# Altium schematic sheet LPCB234 - PI.SchDoc
size A3; Address1: Factory 10; Address2: 9-13 Dingley Avenue, Dandeong, VICTORIA 3175, AUSTRALIA; DocumentNumber: 8; Revision: 1; SheetNumber: 8; SheetTotal: 10; Lockie__PCB_SUB_ASSEMBLY: PI Interface; Lockie__PCB_ASSEMBLY: Main; Lockie__LDL: LPCB234; Lockie__PCB_DESCRIPTION: RM4 Power Node
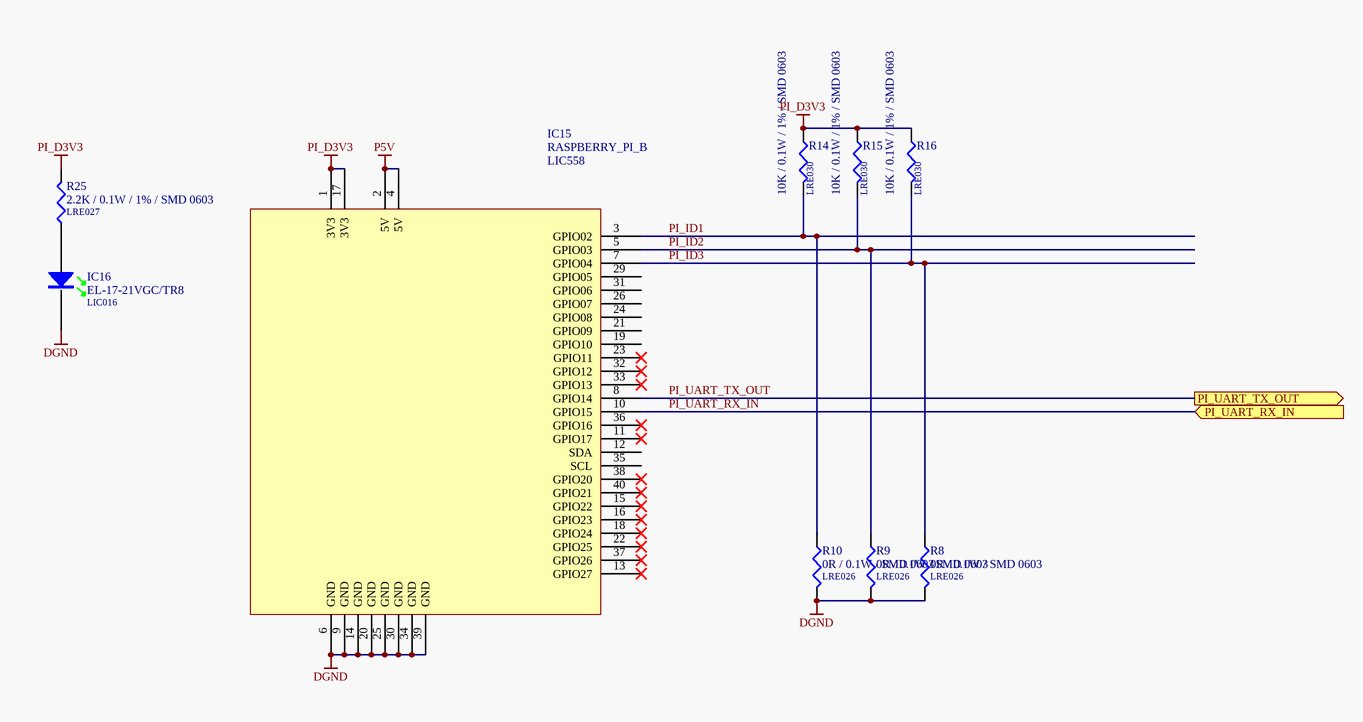
[diagram p0: LPCB234 - PI.SchDoc]

## Parts
IC15  RASPBERRY_PI_B  LDL_NUMBER: LIC558  [RASPBERRY_PI_B_VERT]
IC16  EL-17-21VGC/TR8  LDL_NUMBER: LIC016  [CR2012-0805-LED]
R8  0R / 0.1W / SMD 0603  LDL_NUMBER: LRE026  [LFP020__CR1608-0603-IPC7351_B]
R9  0R / 0.1W / SMD 0603  LDL_NUMBER: LRE026  [LFP020__CR1608-0603-IPC7351_B]
R10  0R / 0.1W / SMD 0603  LDL_NUMBER: LRE026  [LFP020__CR1608-0603-IPC7351_B]
R14  10K / 0.1W / 1% / SMD 0603  LDL_NUMBER: LRE030  [LFP020__CR1608-0603-IPC7351_B]
R15  10K / 0.1W / 1% / SMD 0603  LDL_NUMBER: LRE030  [LFP020__CR1608-0603-IPC7351_B]
R16  10K / 0.1W / 1% / SMD 0603  LDL_NUMBER: LRE030  [LFP020__CR1608-0603-IPC7351_B]
R25  2.2K / 0.1W / 1% / SMD 0603  LDL_NUMBER: LRE027  [LFP020__CR1608-0603-IPC7351_B]

## Ports
PI_UART_RX_IN (in), PI_UART_TX_OUT (out)

## Nets
DGND: IC15.6(GND) IC15.9(GND) IC15.14(GND) IC15.20(GND) IC15.25(GND) IC15.30(GND) IC15.34(GND) IC15.39(GND) IC16.K R8.2 R9.2 R10.2
P5V: IC15.2(5V) IC15.4(5V)
PI_D3V3: IC15.1(3V3) IC15.17(3V3) R14.1 R15.1 R16.1 R25.2
PI_ID1: IC15.3(GPIO02) R10.1 R14.2
PI_ID2: IC15.5(GPIO03) R9.1 R15.2
PI_ID3: IC15.7(GPIO04) R8.1 R16.2
PI_UART_RX_IN: IC15.10(GPIO15) ; port PI_UART_RX_IN
PI_UART_TX_OUT: IC15.8(GPIO14) ; port PI_UART_TX_OUT
NetIC16_A: IC16.A R25.1

Not connected (* = marked no-connect by the designer): IC15 11(GPIO17)* 12(SDA) 13(GPIO27)* 15(GPIO22)* 16(GPIO23)* 18(GPIO24)* 19(GPIO10) 21(GPIO09) 22(GPIO25)* 23(GPIO11)* 24(GPIO08) 26(GPIO07) 29(GPIO05) 31(GPIO06) 32(GPIO12)* 33(GPIO13)* 35(SCL) 36(GPIO16)* 37(GPIO26)* 38(GPIO20)* 40(GPIO21)*

## Notes on the sheet
- PCB COMPONENT DESCRIPTION
- LDL NUMBER
- Assembly Details
- Size
- Drawing File Name
- Revision
- http://rloop.org
- Scale
- A3
- Sheet Details
- N.T.S
- Sheet:
- Of:

## Library data of the parts
IC15 = RASPBERRY_PI_B: Raspberry Pi Model B
IC16 = EL-17-21VGC/TR8: LED, SMD, 0805 Green [LIC016]; FMEDA__OPERATING__TEMP_MAX: 50; FMEDA__OPERATING__TEMP_MIN: -20; FMEDA__OPERATING__TEMP_TYP: 27; FMEDA__CHANNEL: COM; FMEDA__FUNCTION_IN_SYSTEM: *
R8-R10 = 0R / 0.1W / SMD 0603: Resistor, Ceramic Chip, 0R, 0.1W, SMD 0603 [LRE026]; Value: 0; FMEDA__OPERATING__TEMP_MAX: 50; FMEDA__OPERATING__TEMP_MIN: -20; FMEDA__OPERATING__TEMP_TYP: 27; FMEDA__CHANNEL: COM; FMEDA__OPERATING__POWER_MAX: 0; FMEDA__OPERATING__POWER_MIN: 0; FMEDA__OPERATING__VOLTAGE_MAX: 0; FMEDA__OPERATING__VOLTAGE_MIN: 0; FMEDA__OPERATING__VOLTAGE_TYP: 0; FMEDA__FUNCTION_IN_SYSTEM: *
R14-R16 = 10K / 0.1W / 1% / SMD 0603: Resistor, Ceramic Chip, 10K, 0.1W, 1%, SMD 0603 [LRE030]; FMEDA__OPERATING__POWER_MAX: 0; FMEDA__OPERATING__TEMP_MAX: 50; FMEDA__OPERATING__TEMP_MIN: -20; FMEDA__OPERATING__TEMP_TYP: 27; FMEDA__CHANNEL: COM; Value: 10K; FMEDA__OPERATING__POWER_MIN: 0; FMEDA__OPERATING__VOLTAGE_MAX: 0; FMEDA__OPERATING__VOLTAGE_MIN: 0; FMEDA__OPERATING__VOLTAGE_TYP: 0; FMEDA__FUNCTION_IN_SYSTEM: *
R25 = 2.2K / 0.1W / 1% / SMD 0603: Resistor, Ceramic Chip, 2.2K, 0.1W, 1%, SMD 0603 [LRE027]; FMEDA__OPERATING__VOLTAGE_MIN: 0; FMEDA__OPERATING__TEMP_MIN: -20; FMEDA__OPERATING__TEMP_TYP: 27; FMEDA__OPERATING__TEMP_MAX: 50; FMEDA__CHANNEL: COM; VALUE: 2.2K; FMEDA__OPERATING__VOLTAGE_MAX: 0; FMEDA__OPERATING__POWER_MIN: 0; FMEDA__OPERATING__POWER_MAX: 0; FMEDA__FUNCTION_IN_SYSTEM: *; FMEDA__OPERATING__VOLTAGE_TYP: 0